# Altium schematic sheet TESTER_REMOTE_SWITCHING_01.SchDoc: TESTER_REMOTE_CONTROLLER
size A4; CheckedBy: A_MOALLEMI; DrawnBy: A_RAJABI; SheetNumber: 2; SheetTotal: 3
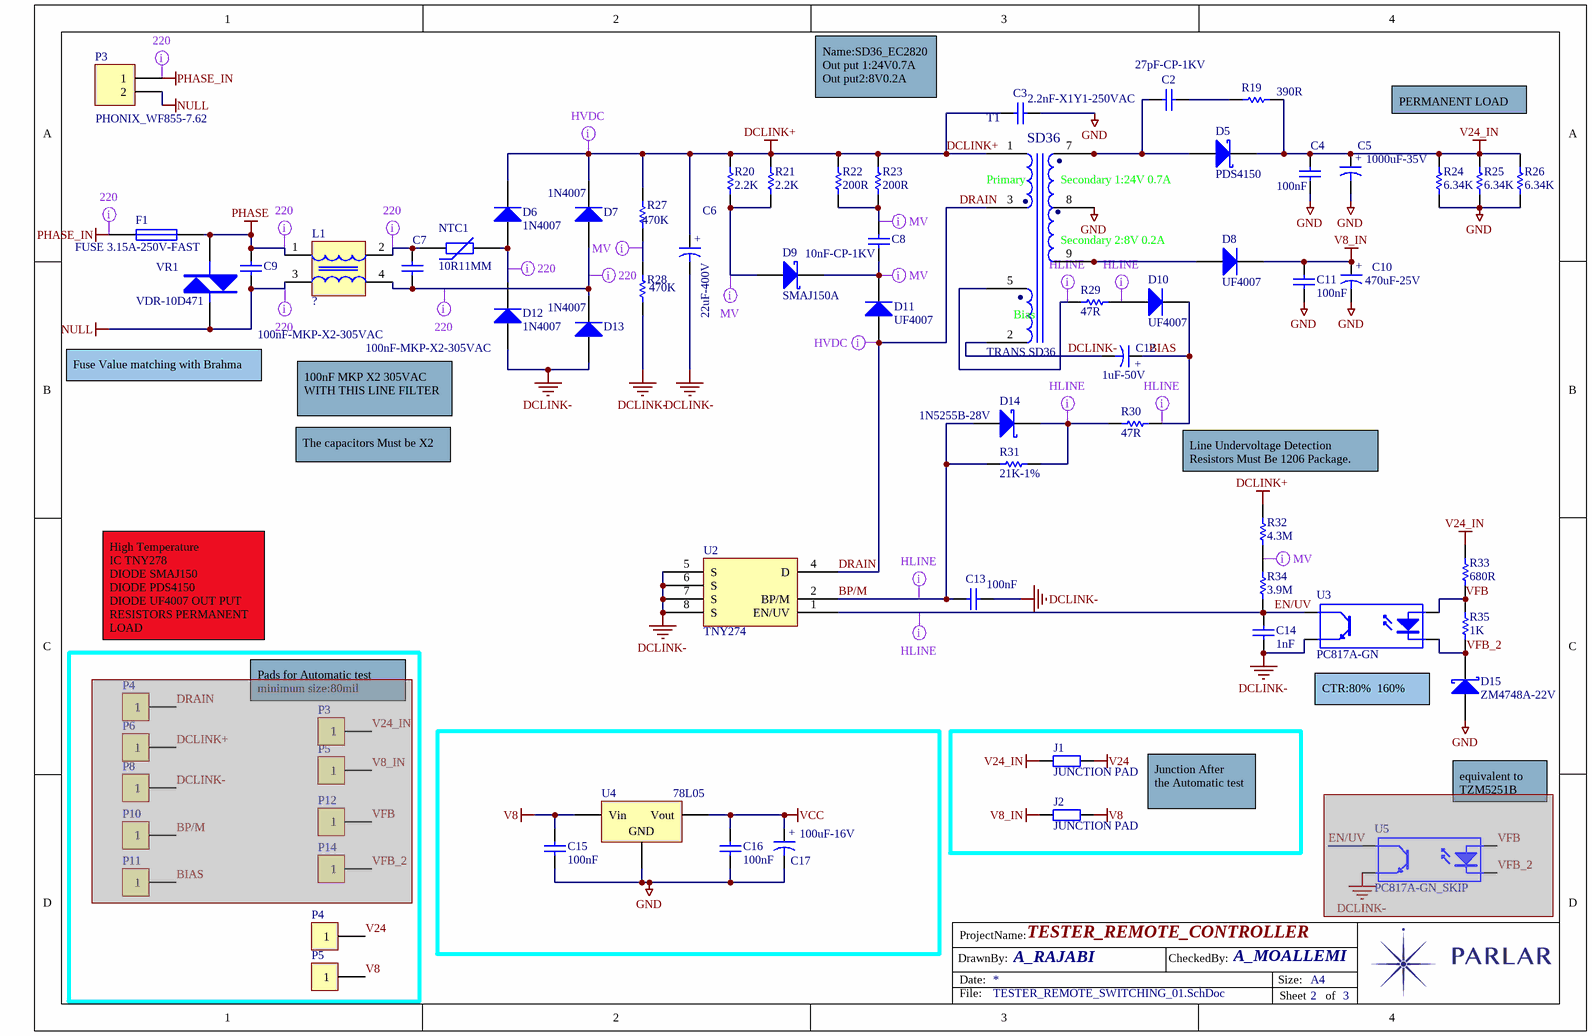
[diagram p0: TESTER_REMOTE_SWITCHING_01.SchDoc]

## Parts
(Parts that share a designator on the sheet are numbered #1, #2 ... from top to bottom, then left to right.)
C2  27pF-CP-1KV  [VDR D10 P7.5]
C3  2.2nF-X1Y1-250VAC  [VDR D10 P10]
C4  100nF  [SMD 0805]
C5  1000uF-35V  [CAP EL D13 P5]
C6  22uF-400V  [CAP EL D16 P5]
C7  100nF-MKP-X2-305VAC  [CAP RAD X13 Y5 P10]
C8  10nF-CP-1KV  [VDR D10 P7.5]
C9  100nF-MKP-X2-305VAC  [CAP RAD X13 Y5 P10]
C10  470uF-25V  [CAP EL D08 P3.5]
C11  100nF  [SMD 0805]
C12  1uF-50V  [CAP EL D06.3 P2.5]
C13  100nF  [SMD 0805]
C14  1nF  [SMD 0805]
C15  100nF  [SMD 0805]
C16  100nF  [SMD 0805]
C17  100uF-16V  [CAP EL D06.3 P2.5]
D5  PDS4150  [SMD POWERDI 5]
D6  1N4007  [SMD SMA]
D7  1N4007  [SMD SMA]
D8  UF4007  [SMD SMA]
D9  SMAJ150A  [SMD SMA]
D10  UF4007  [SMD SMA]
D11  UF4007  [SMD SMA]
D12  1N4007  [SMD SMA]
D13  1N4007  [SMD SMA]
D14  1N5255B-28V  [SMD MINIMELF SOD80]
D15  ZM4748A-22V  [SMD DO-41]
F1  FUSE 3.15A-250V-FAST  [FUSE P5.3MM H1.3MM]
J1  JUNCTION PAD  [PAD JUNCTION]
J2  JUNCTION PAD  [PAD JUNCTION]
L1  ?  [CH CCSP]
NTC1  10R11MM  [VDR D10 P7.5]
P3#1  PHONIX_WF855-7.62  [CON PHOENIX2 7.5 2]
P3#2  CONNECTOR 1  [PAD TEST]  (value not drawn)  (masked out: inside a compile mask, not in the netlist)
P4#1  CONNECTOR 1  [PAD TEST]  (value not drawn)  (masked out: inside a compile mask, not in the netlist)
P4#2  CONNECTOR 1  [PAD TEST]  (value not drawn)
P5#1  CONNECTOR 1  [PAD TEST]  (value not drawn)  (masked out: inside a compile mask, not in the netlist)
P5#2  CONNECTOR 1  [PAD TEST]  (value not drawn)
P6  CONNECTOR 1  [PAD TEST]  (value not drawn)  (masked out: inside a compile mask, not in the netlist)
P8  CONNECTOR 1  [PAD TEST]  (value not drawn)  (masked out: inside a compile mask, not in the netlist)
P10  CONNECTOR 1  [PAD TEST]  (value not drawn)  (masked out: inside a compile mask, not in the netlist)
P11  CONNECTOR 1  [PAD TEST]  (value not drawn)  (masked out: inside a compile mask, not in the netlist)
P12  CONNECTOR 1  [PAD TEST]  (value not drawn)  (masked out: inside a compile mask, not in the netlist)
P14  CONNECTOR 1  [PAD TEST]  (value not drawn)  (masked out: inside a compile mask, not in the netlist)
R19  390R  [SMD 1206]
R20  2.2K  [SMD 1206]
R21  2.2K  [SMD 1206]
R22  200R  [SMD 1206]
R23  200R  [SMD 1206]
R24  6.34K  [SMD 1206]
R25  6.34K  [SMD 1206]
R26  6.34K  [SMD 1206]
R27  470K  [SMD 1206]
R28  470K  [SMD 1206]
R29  47R  [SMD 1206]
R30  47R  [SMD 1206]
R31  21K-1%  [SMD 1206]
R32  4.3M  [SMD 1206]
R33  680R  [SMD 1206]
R34  3.9M  [SMD 1206]
R35  1K  [SMD 0805]
T1  TRANS SD36  [TR EC28/20 VER 5+5]
U2  TNY274  [DIP8]
U3  PC817A-GN  [DIP4]
U4  78L05  [SMD DPAK]
U5  PC817A-GN_SKIP  [SMD IC SOP4]  (masked out: inside a compile mask, not in the netlist)
VR1  VDR-10D471  [VDR D10 P7.5]

## Nets
DCLINK+: C3.2 C6.1 D6.2 D7.2 R20.2 R21.2 R22.2 R23.2 R27.2 R32.2 T1.1
DCLINK-: C6.2 C12.2 C13.2 C14.2 D12.1 D13.1 R28.1 T1.2 U2.5(S) U2.6(S) U2.7(S) U2.8(S) U3.3(E)
GND: C3.1 C4.2 C5.2 C10.2 C11.2 C15.2 C16.2 C17.2 D15.1 R24.2 R25.2 R26.2 T1.8 U4.2(GND)
NULL: C9.2 L1.3 P3#1.2 VR1.1
PHASE: C9.1 F1.2 L1.1 VR1.2
PHASE_IN: F1.1 P3#1.1
V8: C15.1 J2.2 P5#2.1 U4.1(Vin)
V8_IN: C10.1 C11.1 D8.2 J2.1
V24: J1.2 P4#2.1
V24_IN: C4.1 C5.1 D5.2 J1.1 R19.2 R24.1 R25.1 R26.1 R33.2
VCC: C16.1 C17.1 U4.3(Vout)
BIAS: C12.1 D10.2 R30.1
BP/M: C13.1 D14.1 R31.2 U2.2(BP/M)
DRAIN: D11.1 T1.3 U2.4(D)
EN/UV: C14.1 R34.1 U2.1(EN/UV) U3.4(C)
VFB: R33.1 R35.2 U3.1(A)
VFB_2: D15.2 R35.1 U3.2(K)
NetC2_1: C2.1 R19.1
NetC2_2: C2.2 D5.1 T1.6 T1.7
NetC7_1: C7.1 L1.2 NTC1.1
NetC7_2: C7.2 D7.1 D13.2 L1.4
NetC8_1: C8.1 R22.1 R23.1
NetC8_2: C8.2 D9.2 D11.2
NetD6_1: D6.1 D12.2 NTC1.2
NetD8_1: D8.1 T1.9 T1.10
NetD9_1: D9.1 R20.1 R21.1
NetD10_1: D10.1 R29.1
NetD14_2: D14.2 R30.2 R31.1
NetR27_1: R27.1 R28.2
NetR29_2: R29.2 T1.5
NetR32_1: R32.1 R34.2

## Layout directives
net class 220: NetC7_1, NetC7_2, NetD6_1, NULL, PHASE, PHASE_IN
net class HVDC: DCLINK+, DRAIN
net class MV: NetC8_1, NetC8_2, NetD9_1, NetR27_1, NetR32_1
net class Hline: BIAS, BP/M, EN/UV, NetD10_1, NetD14_2, NetR29_2

## Notes on the sheet
- Name:SD36_EC2820
  Out put 1:24V0.7A
  Out put2:8V0.2A
- PERMANENT LOAD
- Fuse Value matching with Brahma
- 100nF MKP X2 305VAC WITH THIS LINE FILTER
- The capacitors Must be X2
- Line Undervoltage Detection Resistors Must Be 1206 Package.
- High Temperature
  IC TNY278
  DIODE SMAJ150
  DIODE PDS4150
  DIODE UF4007 OUT PUT
  RESISTORS PERMANENT LOAD
- (near P3#2) Pads for Automatic test
  minimum size:80mil
- CTR:80%  160%
- Junction After      the Automatic test
- equivalent to TZM5251B
- DrawnBy:
- ProjectName:
- Date:
- CheckedBy:
- Size:
- A4
- File:
- Sheet
- of
- (in symbol CAP POL) +
- (in symbol TRANS SD36) SD36; .; Primary; Secondary 1:24V 0.7A; Secondary 2:8V 0.2A; Bias

## Library data of the parts
C2-C4 C7-C9 C11 C13-C16 = CAP: Capacitor; Published: 8-Jun-2000; LatestRevisionDate: 17-Jul-2002; LatestRevisionNote: Re-released for DXP Platform.; PackageReference: RAD-0.3; Publisher: Altium Limited; PackageDescription: Radial Cap, Thru-Hole; 2 Leads; 0.3 in Pin Spacing
C5 C6 C10 C12 C17 = CAP POL: Capacitor  Polarized; Published: 23-Sep-2002; PackageReference: CAPR5-4X5; Publisher: Altium Limited; PackageDescription: Capacitor; 2 Leads; Parameter 1: *
D5 = DIODE SCHOTTKY: Schottky Diode
D6-D8 D10-D13 = DIODE: Typical Diode
D9 D14 D15 = DIODE ZENER: Zener Diode
F1 = FUSE: Published: 8-Jun-2000; LatestRevisionDate: 17-Jul-2002; LatestRevisionNote: Re-released for DXP Platform.; PackageReference: PIN-W2/E2.8; Publisher: Altium Limited; PackageDescription: Thru-Hole; 2 Leads
J1 J2 = RES JUNCTION: Resistor; Published: 8-Jun-2000; LatestRevisionDate: 17-Jul-2002; LatestRevisionNote: Re-released for DXP Platform.; PackageReference: AXIAL-0.4; Publisher: Altium Limited; PackageDescription: Axial Device, Thru-Hole; 2 Leads; 0.4 in Pin Spacing
L1 = EMI FILTER
NTC1 = RES VARISTOR: Varistor (Voltage-Sensitive Resistor); Published: 24-Mar-1999; LatestRevisionDate: 29-May-2009; LatestRevisionNote: IPC-7351 Footprint Added.; PackageVersion: Mar-2003; PackageReference: 6-0805; Publisher: Altium Limited; PackageDescription: Chip Resistor 0805 Case Size; Code_IPC: RESC2012
P3#1 = CONNECTOR 2: Header, 2-Pin; LatestRevisionDate: 17-Jul-2002; LatestRevisionNote: Re-released for DXP Platform.; Publisher: Altium Limited
P3#2 P4#1 P4#2 P5#1 P5#2 P6 P8 P10-P12 P14 = CONNECTOR 1: The BS81x is a series of 2~16 key touch key devices; LatestRevisionDate: 17-Jul-2002; LatestRevisionNote: Re-released for DXP Platform.; Publisher: Altium Limited
R19-R35 = RES: Resistor
T1 = TRANS SD36: Transformer
U2 = IC TNY274: AC to DC Switching Converter Off-Line Switcher 140kHz, 7-Pin
U3 U5 = OPTO COPLER: 4-Pin Phototransistor Optocoupler; Published: 24-Mar-1999; LatestRevisionDate: 04-Mar-2005; LatestRevisionNote: Sch pins 3 & 4 Swapped.; DatasheetVersion: Nov-2003; PackageReference: DIP-4; Publisher: Altium Limited
U4 = VOLT REG: Voltage Regulator; Published: 24-Mar-1999; LatestRevisionDate: 29-May-2009; LatestRevisionNote: IPC-7351 Footprint Added.; PackageReference: D2PAK; Publisher: Altium Limited; PackageDescription: 3-Pin Transistor Outline Package 2.54 mm Pitch, 15.1 mm Lead Span
VR1 = VDR: Typical VDR